# EAGLE schematic touch_board (EAGLE 9.5.0)
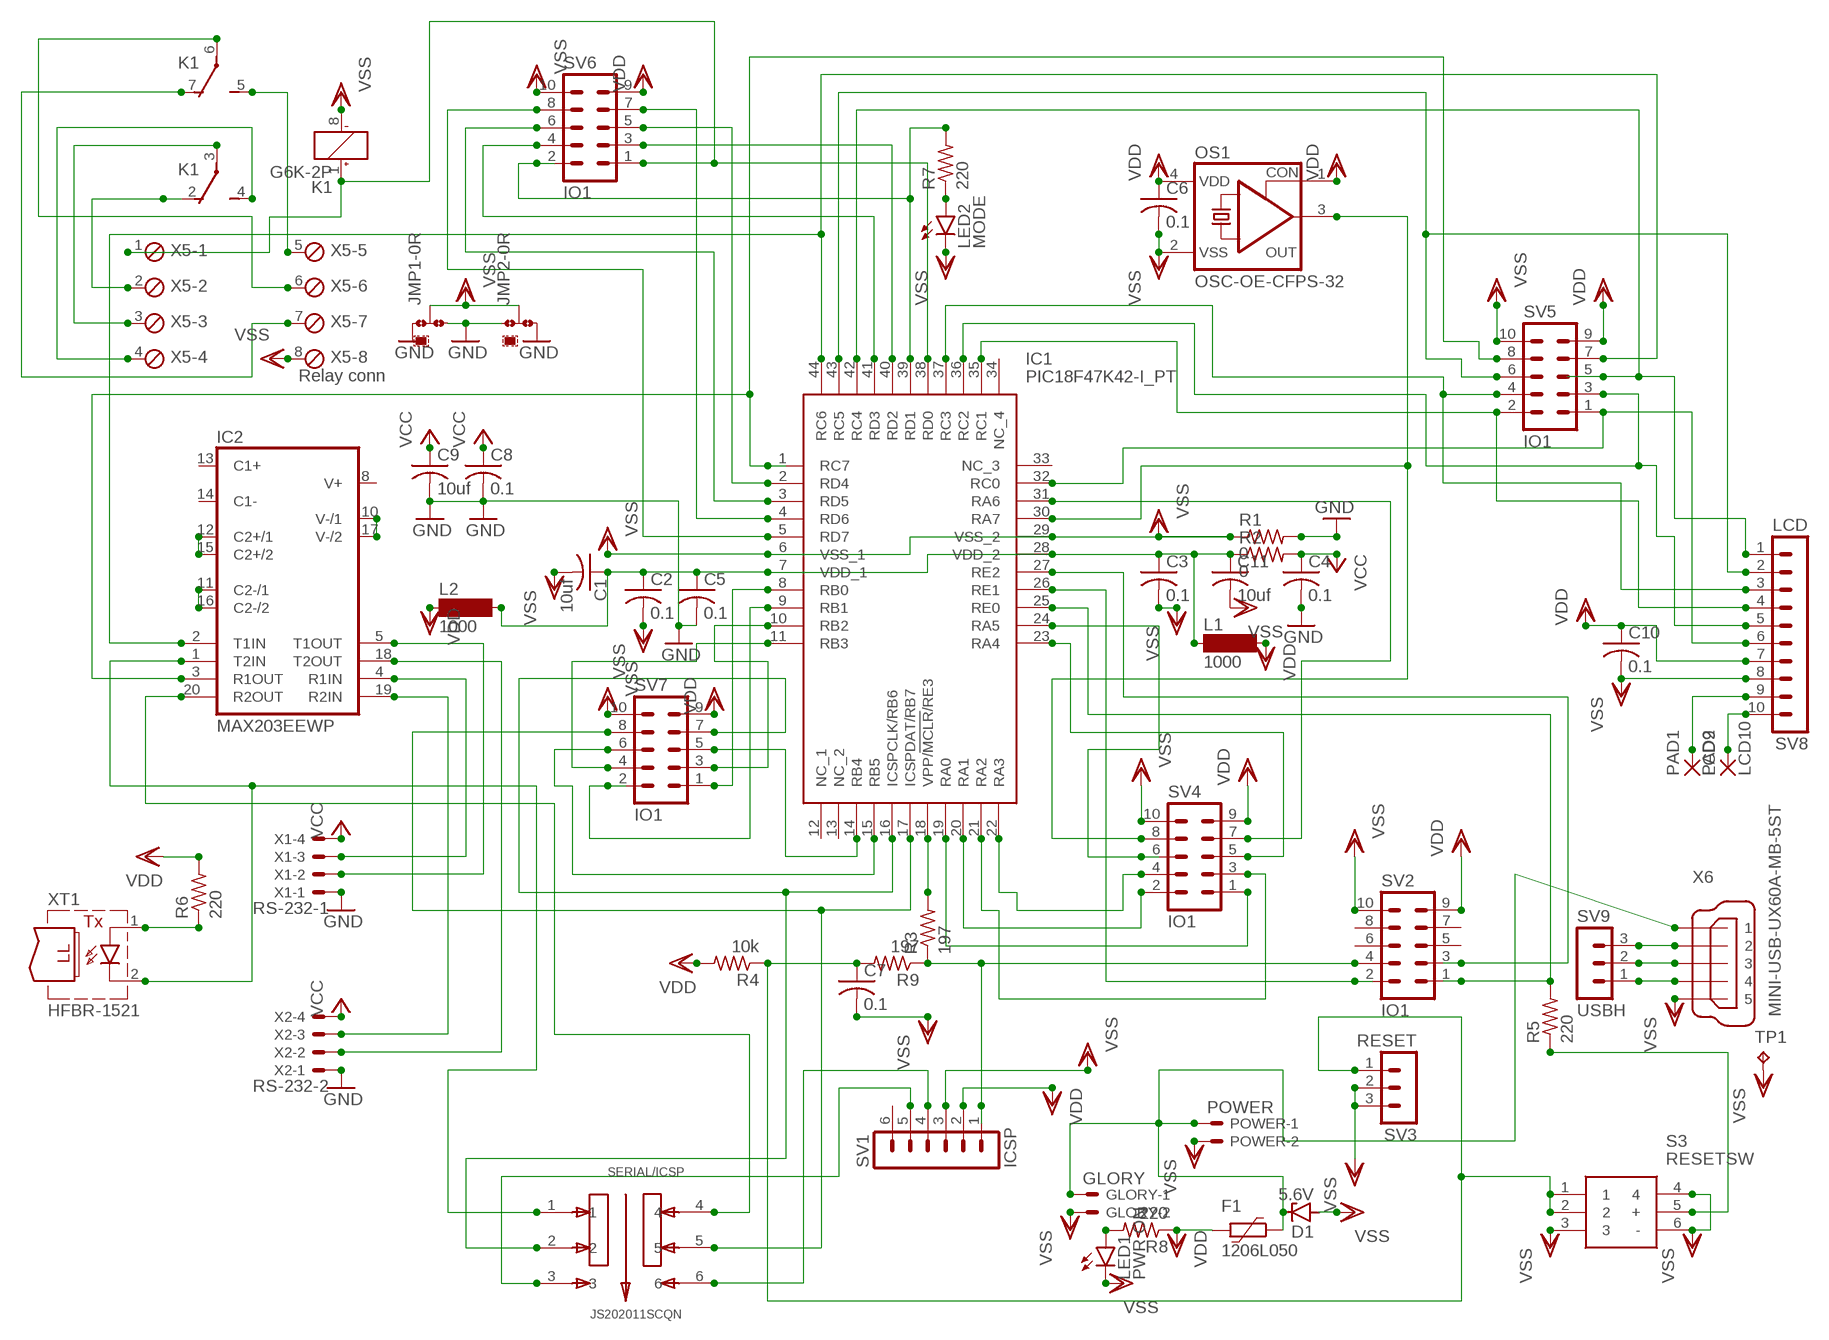
[diagram p0: schematic, sheet 1]

## Parts
C1  10uf  C-USC0805  [C0805]
C2  0.1  C-USC0805  [C0805]
C3  0.1  C-USC0805  [C0805]
C4  0.1  C-USC0805  [C0805]
C5  0.1  C-USC0805  [C0805]
C6  0.1  C-USC0805  [C0805]
C7  0.1  C-USC0805  [C0805]
C8  0.1  C-USC0805  [C0805]
C9  10uf  C-USC0805  [C0805]
C10  0.1  C-USC0805  [C0805]
C11  10uf  C-USC0805  [C0805]
D1  5.6V  ZENER-DIODEZD-7.5  [ZDIO-7.5]
F1  1206L050  [1206L]
GLORY  GLORY  22-23-2021  [22-23-2021]
IC1  PIC18F47K42-I_PT  [QFP80P1200X1200X120-44N]
IC2  MAX203EEWP  [SO20L]
JMP1  0R-JUMPA  [A0R-JMP]
JMP2  0R-JUMPA  [A0R-JMP]
K1  G6K-2P  [G6K-2P]
L1  1000  SM-1206  [SM-1206]
L2  1000  SM-1206  [SM-1206]
LED1  PWR ON  LEDCHIPLED_1206  [CHIPLED_1206]
LED2  MODE  LEDCHIPLED_1206  [CHIPLED_1206]
OS1  OSC-OE-CFPS-32  [7.2X5.2-4-PAD]
PAD1  LCD9  SMD2  [SMD1,27-2,54]
PAD2  LCD10  SMD2  [SMD1,27-2,54]
POWER  POWER  22-23-2021  [22-23-2021]
R1  0  R-US_R0805  [R0805]
R2  0  R-US_R0805  [R0805]
R3  197  R-US_R0805  [R0805]
R4  10k  R-US_R0805  [R0805]
R5  220  R-US_R0805  [R0805]
R6  220  R-US_R0805  [R0805]
R7  220  R-US_R0805  [R0805]
R8  220  R-US_R0805  [R0805]
R9  197  R-US_R0805  [R0805]
S3  RESETSW  B3W-9000-Y1N  [B3W-9_1-LED]
SERIAL/ICSP  JS202011SCQN  [SW_JS202011SCQN]
SV1  ICSP  MA06-1  [MA06-1]
SV2  IO1  MA05-2  [MA05-2]
SV3  RESET  MA03-1  [MA03-1]
SV4  IO1  MA05-2  [MA05-2]
SV5  IO1  MA05-2  [MA05-2]
SV6  IO1  MA05-2  [MA05-2]
SV7  IO1  MA05-2  [MA05-2]
SV8  LCD  MA10-1  [MA10-1]
SV9  USBH  MA03-1  [MA03-1]
TP1  TPB1,27  [B1,27]
X1  RS-232-1  22-23-2041  [22-23-2041]
X2  RS-232-2  22-23-2041  [22-23-2041]
X5  Relay conn  MPT8  [8POL254]
X6  MINI-USB-UX60A-MB-5ST  [UX60A-MB-5ST]
XT1  HFBR-1521  [HFBR-15X3]

## Nets
GND: C4.2 C5.2 C8.2 C9.2 JMP1.1 JMP1.3 JMP2.1 JMP2.3 R1.2 X1.1 X2.1
N$1: IC1.30(RA7) OS1.3(OUT) SV4.8
N$2: R3.1 R9.1 SV1.1 SV2.4
N$3: IC1.18(VPP/!MCLR!/RE3) R3.2
N$4: IC1.25(RE0) R5.2 SV2.1
N$5: IC1.26(RE1) SV2.2
N$6: IC1.17(ICSPDAT/RB7) SERIAL/ICSP.5 SV7.8
N$7: IC1.16(ICSPCLK/RB6) SERIAL/ICSP.2 SV7.7
N$8: IC1.27(RE2) SV2.3
N$9: R5.1 S3.5(+)
N$10: IC1.39(RD1) R7.2 SV6.2
N$11: LED2.A R7.1
N$12: IC2.11(C2-/1) IC2.16(C2-/2)
N$13: IC2.10(V-/1) IC2.17(V-/2)
N$14: IC2.12(C2+/1) IC2.15(C2+/2)
N$15: IC2.5(T1OUT) X1.2
N$16: IC2.18(T2OUT) X2.2
N$17: IC2.4(R1IN) X1.3
N$18: IC2.19(R2IN) X2.3
N$19: IC1.44(RC6) IC2.2(T1IN) SV5.7
N$20: IC2.1(T2IN) SERIAL/ICSP.1 XT1.2(C)
N$21: IC1.1(RC7) IC2.3(R1OUT) SV5.8
N$22: IC2.20(R2OUT) SERIAL/ICSP.4
N$23: SERIAL/ICSP.6 SV1.4
N$25: R6.1 XT1.1(A)
N$26: IC1.19(RA0) SV4.1
N$27: IC1.20(RA1) SV4.2
N$28: IC1.21(RA2) SV4.3
N$29: IC1.22(RA3) SV4.4
N$30: IC1.23(RA4) SV4.5
N$31: IC1.31(RA6) SV4.7
N$32: IC1.24(RA5) SV4.6
N$33: IC1.32(RC0) SV5.1 SV8.6
N$34: IC1.35(RC1) SV5.2 SV8.4
N$35: IC1.36(RC2) SV5.3 SV8.5
N$36: IC1.37(RC3) SV5.4 SV8.3
N$37: LED1.A R8.2
N$38: IC1.43(RC5) SV5.6 SV8.2
N$39: K1.2(2:O) X5.2
N$40: IC1.40(RD2) SV6.3
N$41: IC1.41(RD3) SV6.4
N$42: IC1.2(RD4) SV6.5
N$43: IC1.3(RD5) SV6.6
N$44: IC1.4(RD6) SV6.7
N$45: IC1.5(RD7) SV6.8
N$46: IC1.8(RB0) SV7.1
N$47: IC1.9(RB1) SV7.2
N$48: IC1.10(RB2) SV7.3
N$49: IC1.11(RB3) SV7.4
N$50: IC1.14(RB4) SV7.5
N$51: IC1.15(RB5) SV7.6
N$52: IC1.38(RD0) K1.1(1:+) SV6.1 X5.1
N$53: K1.3(2:P) X5.3
N$54: K1.4(2:S) X5.4
N$55: K1.5(3:S) X5.5
N$56: K1.6(3:P) X5.6
N$57: K1.7(3:O) X5.7
N$58: C1.1 C2.1 C3.1 C5.1 C11.1 IC1.7(VDD_1) IC1.28(VDD_2) L1.1 L2.2 R2.1
N$59: SV9.3 X6.2
N$60: D1.C F1.1 GLORY.1 POWER.1 X6.1
N$61: SV9.2 X6.3
N$62: C7.1 R4.1 R9.2 S3.1 S3.2 SV3.1
N$63: IC1.42(RC4) SV5.5 SV8.1
N$64: SV9.1 X6.4
N$65: SERIAL/ICSP.3 SV1.5
N$66: PAD1.1(P) SV8.9
N$67: PAD2.1(P) SV8.10
VCC: C4.1 C8.1 C9.1 R2.2 X1.4 X2.4
VDD: C6.1 C10.1 F1.2 L1.2 L2.1 OS1.1(CON) OS1.4(VDD) R4.2 R6.2 R8.1 SV1.2 SV2.9 SV4.9 SV5.9 SV6.9 SV7.9 SV8.7
VSS: C1.2 C2.2 C3.2 C6.2 C7.2 C10.2 C11.2 D1.A GLORY.2 IC1.6(VSS_1) IC1.29(VSS_2) JMP1.2 JMP2.2 K1.8(1:-) LED1.C LED2.C OS1.2(VSS) POWER.2 R1.1 S3.3 S3.4 S3.6(-) SV1.3 SV2.10 SV3.2 SV3.3 SV4.10 SV5.10 SV6.10 SV7.10 SV8.8 TP1.TP X5.8 X6.5
Unconnected: IC1.12(NC_1) IC1.13(NC_2) IC1.33(NC_3) IC1.34(NC_4) IC2.8(V+) IC2.13(C1+) IC2.14(C1-) SV1.6 SV2.5 SV2.6 SV2.7 SV2.8

## Power pins joined to a net without a drawn wire
GND: IC2.6(GND) IC2.9(GND)
VCC: IC2.7(VCC)

## Library data of the parts
C1-C11 = rcl:C-US: CAPACITOR, American symbol; SPICEPREFIX: C
D1 = diode:ZENER-DIODE: Z-Diode
F1 = polyfuse-smd_10:?: Polyfuse Resettable PTC Source: http://www.littelfuse.com/products/resettable-ptcs.aspx; MF: Littelfuse; MPN: 1206L050; OC_FARNELL: 1596993; OC_NEWARK: 53M6118
GLORY POWER = con-molex:22-23-2021: .100" (2.54mm) Center Header - 2 Pin; MF: MOLEX; MPN: 22-23-2021; OC_FARNELL: 1462926; OC_NEWARK: 25C3832
IC1 = PIC18F47K42-I_PT:PIC18F47K42-I_PT: MICROCHIP - PIC18F47K42-I/PT - MCU, 8BIT, 64MHZ, TQFP-44 Source: Datasheet <https://www.microchip.com/wwwproducts/en/PIC18F47K42#additional-features>; DESCRIPTION: MICROCHIP - PIC18F47K42-I/PT - MCU, 8BIT, 64MHZ, TQFP-44; HEIGHT: 1.2mm; MANUFACTURER_NAME: Microchip; MANUFACTURER_PART_NUMBER: PIC18F47K42-I/PT; MOUSER_PART_NUMBER: 579-PIC18F47K42-I/PT; MOUSER_PRICE-STOCK: https://www.mouser.com/Search/Refine.aspx?Keyword=579-PIC18F47K42-I%2FPT
IC2 = maxim-10:MAX203*: RS232 TRANSEIVER
JMP1 JMP2 = jump-0r-smd:0R-JUMP: SMD 0R 0805 Jumper
K1 = relay:G6K: Low Signal Relay oeiwcsnts1.omron.com/.. D20G6K0100.pdf; MF: OMRON COMPONENTS USA; MPN: G6K-2P DC3; OC_FARNELL: 3937276; OC_NEWARK: 89C6482
L1 L2 = inductor-neosid:SM-1206: INDUCTOR SMD chip inductor; OC_FARNELL: unknown; OC_NEWARK: unknown
LED1 LED2 = led:LED: LED OSRAM: - CHIPLED LG R971, LG N971, LY N971, LG Q971, LY Q971, LO R971, LY R971 LH N974, LH R974 LS Q976, LO Q976, LY Q976 LO Q996 - Hyper CHIPLED LW Q18S LB Q993, LB Q99A, LB R99A - SideLED LS A670, LO A670, LY A670, LG A670, LP A670 LB A673, LV A673, LT A673, LW A673 LH A674 LY A675 LS A676, LA A676, LO A676, LY A676, LW A676 LS A679, LY A679, LG A679 - Hyper Micro SIDELED® LS Y876, LA Y876, LO Y876, LY Y876 LT Y87S - SmartLED LW L88C, LW L88S LB L89C, LB L89S, LG L890 LS L89K, LO L89K, LY L89K LS L896, LA L896, LO L896, LY L896 - TOPLED LS T670, LO T670, LY T670, LG T670, LP T670 LSG T670, LSP T670, LSY T670, LOP T670, LYG T670 LG T671, LOG T671, LSG T671 LB T673, LV T673, LT T673, LW T673 LH T674 LS T676, LA T676, LO T676, LY T676, LB T676, LH T676, LSB T676, LW T676 LB T67C, LV T67C, LT T67C, LS T67K, LO T67K, LY T67K, LW E67C LS E67B, LA E67B, LO E67B, LY E67B, LB E67C, LV E67C, LT E67C LW T67C LS T679, LY T679, LG T679 LS T770, LO T770, LY T770, LG T770, LP T770 LB T773, LV T773, LT T773, LW T773 LH T774 LS E675, LA E675, LY E675, LS T675 LS T776, LA T776, LO T776, LY T776, LB T776 LHGB T686 LT T68C, LB T68C - Hyper Mini TOPLED® LB M676 - Mini TOPLED Santana® LG M470 LS M47K, LO M47K, LY M47K Source: http://www.osram.convergy.de LUXEON: - LUMILED® LXK2-PW12-R00, LXK2-PW12-S00, LXK2-PW14-U00, LXK2-PW14-V00 LXK2-PM12-R00, LXK2-PM12-S00, LXK2-PM14-U00 LXK2-PE12-Q00, LXK2-PE12-R00, LXK2-PE12-S00, LXK2-PE14-T00, LXK2-PE14-U00 LXK2-PB12-K00, LXK2-PB12-L00, LXK2-PB12-M00, LXK2-PB14-N00, LXK2-PB14-P00, LXK2-PB14-Q00 LXK2-PR12-L00, LXK2-PR12-M00, LXK2-PR14-Q00, LXK2-PR14-R00 LXK2-PD12-Q00, LXK2-PD12-R00, LXK2-PD12-S00 LXK2-PH12-R00, LXK2-PH12-S00 LXK2-PL12-P00, LXK2-PL12-Q00, LXK2-PL12-R00 Source: www.luxeon.com KINGBRIGHT: KA-3528ASYC Source: www.kingbright.com
OS1 = IQD-Frequency-Products:OSC-OE: OSCILLATOR WITH OE
PAD1 PAD2 = wirepad:SMD2: SMD PAD
R1-R9 = rcl:R-US_: RESISTOR, American symbol; SPICEPREFIX: R
S3 = SamacSys_Parts:B3W-9000-Y1N: Illuminated Tactile Switches Illuminated Ylw LED White Cap Source: Datasheet <http://www.mouser.com/ds/2/307/en-b3w-9-11824.pdf>; ALLIED_NUMBER: 70176005; ALLIED_PRICE-STOCK: https://www.alliedelec.com/omron-electronic-components-b3w-9000-y1n/70176005/; DESCRIPTION: Illuminated Tactile Switches Illuminated Ylw LED White Cap; HEIGHT: mm; MANUFACTURER_NAME: Omron Electronics; MANUFACTURER_PART_NUMBER: B3W-9000-Y1N; MOUSER_PART_NUMBER: 653-B3W-9000-Y1N; MOUSER_PRICE-STOCK: https://www.mouser.com/Search/Refine.aspx?Keyword=653-B3W-9000-Y1N; RS_PART_NUMBER: 0492777P; RS_PRICE-STOCK: http://uk.rs-online.com/web/p/products/0492777P
SERIAL/ICSP = JS202011SCQN_fixed:JS202011SCQN: JS Series DPDT On-On Gull Wing Surface Mount Subminiature Slide Switch; AVAILABILITY: Unavailable; DESCRIPTION: JS Series DPDT On-On Gull Wing Surface Mount Subminiature Slide Switch; MF: C&K; MP: JS202011SCQN; PACKAGE: None; PRICE: None
SV1 = con-lstb:MA06-1: PIN HEADER; OC_FARNELL: unknown; OC_NEWARK: unknown
SV2 SV4-SV7 = con-lstb:MA05-2: PIN HEADER; OC_FARNELL: unknown; OC_NEWARK: unknown
SV3 SV9 = con-lstb:MA03-1: PIN HEADER; OC_FARNELL: unknown; OC_NEWARK: unknown
SV8 = con-lstb:MA10-1: PIN HEADER; OC_FARNELL: unknown; OC_NEWARK: unknown
TP1 = testpad:TP: Test pad
X1 X2 = con-molex:22-23-2041: .100" (2.54mm) Center Header - 4 Pin; MF: MOLEX; MPN: 22-23-2041; OC_FARNELL: 1462920; OC_NEWARK: 38C0355
X5 = con-phoenix-254:MPT8: PHOENIX CONNECTOR; OC_FARNELL: unknown; OC_NEWARK: unknown
X6 = con-hirose:MINI-USB-: MINI USB Connector Source: http://www.hirose.co.jp/cataloge_hp/e24000019.pdf; OC_FARNELL: unknown; OC_NEWARK: unknown
XT1 = fiber-optic-hp:HFBR-1521: TRANSMITTER low cost miniature fiber optic component, 5-MBd high performance link, vertical; MF: AGILENT TECHNOLOGIES; MPN: HFBR-1521; OC_FARNELL: 1173128; OC_NEWARK: 06F6050